# Altium project BreadBoard_project.PrjPcb (part 2 of 2)

## Sheet tmc4671_Output_Feedback.SchDoc: Output & Feedback
size A4 portrait; DocumentNumber: 3; SheetNumber: 6; SheetTotal: 6
Used 2 times, as channels U_tmc4671_eval/U_tmc4671_Output_Feedback, U_tmc4671_eval/U_tmc4671_Output_Feedback. Parts and nets are listed once, with the designators drawn on the sheet.
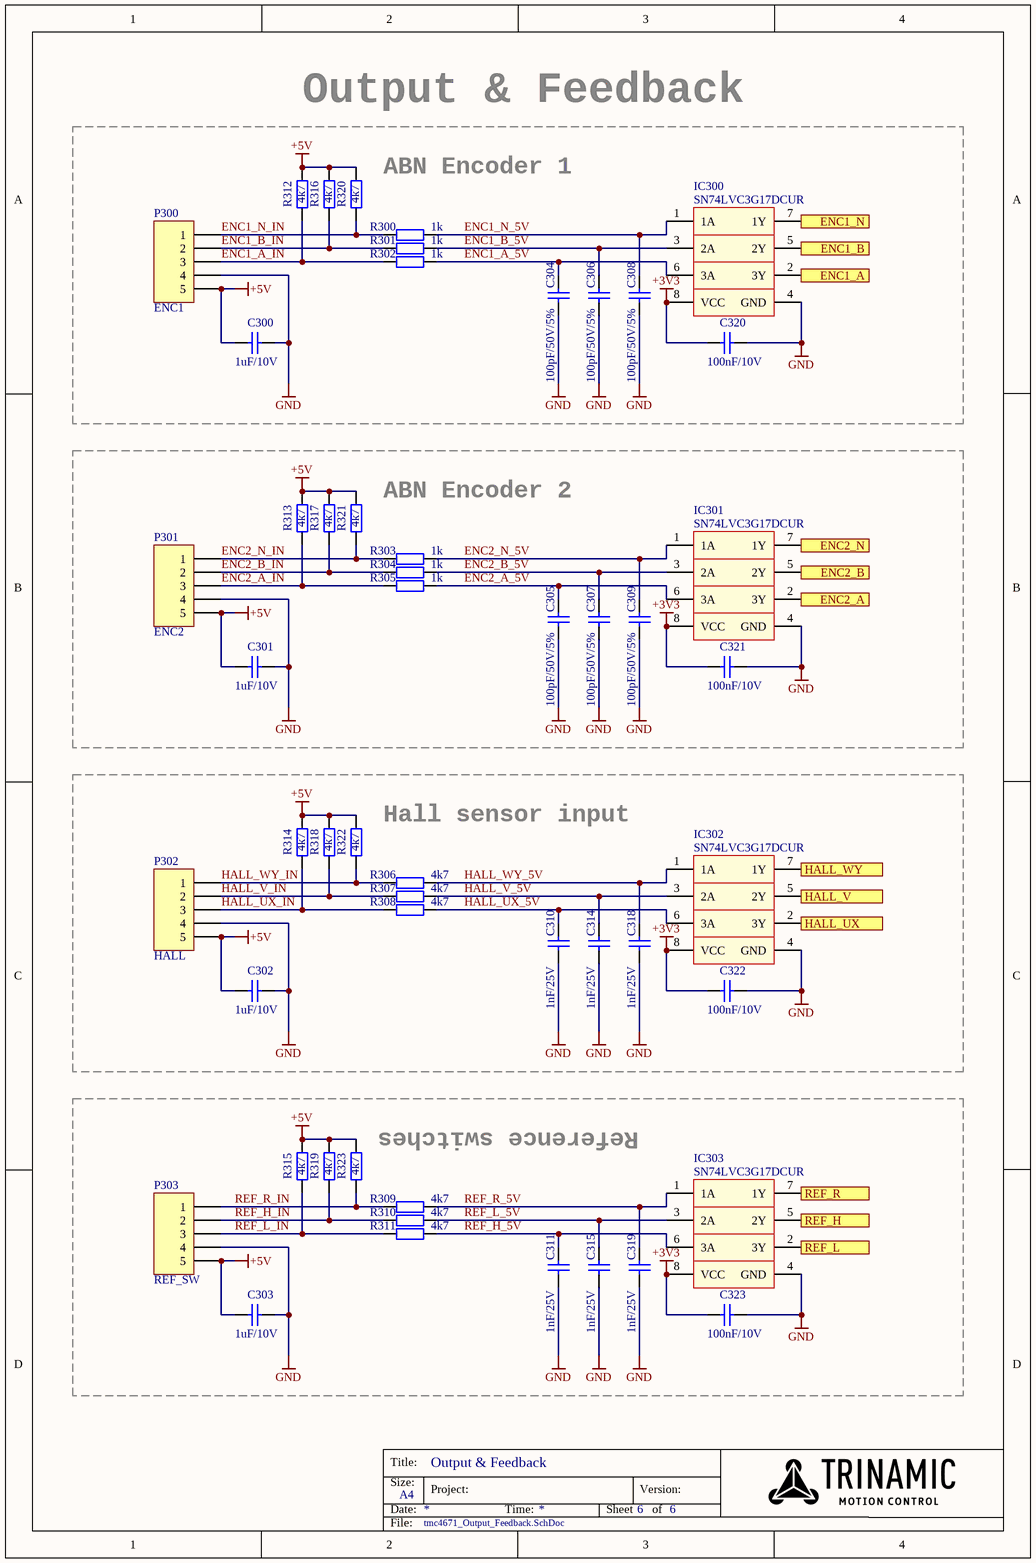
[diagram p5: tmc4671_Output_Feedback.SchDoc]

### Parts
C300  1uF/10V  [C0603]
C301  1uF/10V  [C0603]
C302  1uF/10V  [C0603]
C303  1uF/10V  [C0603]
C304  100pF/50V/5%  [C0603]
C305  100pF/50V/5%  [C0603]
C306  100pF/50V/5%  [C0603]
C307  100pF/50V/5%  [C0603]
C308  100pF/50V/5%  [C0603]
C309  100pF/50V/5%  [C0603]
C310  1nF/25V  [C0603]
C311  1nF/25V  [C0603]
C314  1nF/25V  [C0603]
C315  1nF/25V  [C0603]
C318  1nF/25V  [C0603]
C319  1nF/25V  [C0603]
C320  100nF/10V  [C0603]
C321  100nF/10V  [C0603]
C322  100nF/10V  [C0603]
C323  100nF/10V  [C0603]
IC300  SN74LVC3G17DCUR  [TSSOP50P310X90-8L]
IC301  SN74LVC3G17DCUR  [TSSOP50P310X90-8L]
IC302  SN74LVC3G17DCUR  [TSSOP50P310X90-8L]
IC303  SN74LVC3G17DCUR  [TSSOP50P310X90-8L]
P300  ENC1  [TH_HDR_1X5]
P301  ENC2  [TH_HDR_1X5]
P302  HALL  [TH_HDR_1X5]
P303  REF_SW  [TH_HDR_1X5]
R300  1k  [R0603]
R301  1k  [R0603]
R302  1k  [R0603]
R303  1k  [R0603]
R304  1k  [R0603]
R305  1k  [R0603]
R306  4k7  [R0603]
R307  4k7  [R0603]
R308  4k7  [R0603]
R309  4k7  [R0603]
R310  4k7  [R0603]
R311  4k7  [R0603]
R312  4k7  [R0603]
R313  4k7  [R0603]
R314  4k7  [R0603]
R315  4k7  [R0603]
R316  4k7  [R0603]
R317  4k7  [R0603]
R318  4k7  [R0603]
R319  4k7  [R0603]
R320  4k7  [R0603]
R321  4k7  [R0603]
R322  4k7  [R0603]
R323  4k7  [R0603]

### Blocks framed on the sheet
ABN Encoder 1: C300 C304 C306 C308 C320 IC300 P300 R300-R302 R312 R316 R320
ABN Encoder 2: C301 C305 C307 C309 C321 IC301 P301 R303-R305 R313 R317 R321
Hall sensor input: C302 C310 C314 C318 C322 IC302 P302 R306-R308 R314 R318 R322
Reference switches: C303 C311 C315 C319 C323 IC303 P303 R309-R311 R315 R319 R323

### Ports
ENC1_A, ENC1_B, ENC1_N, ENC2_A, ENC2_B, ENC2_N, HALL_UX, HALL_V, HALL_WY, REF_H, REF_L, REF_R

### Nets
+3V3: C320.2 C321.2 C322.2 C323.2 IC300.8(VCC) IC301.8(VCC) IC302.8(VCC) IC303.8(VCC)
+5V: C300.2 C301.2 C302.2 C303.2 P300.5 P301.5 P302.5 P303.5 R312.2 R313.2 R314.2 R315.2 R316.2 R317.2 R318.2 R319.2 R320.2 R321.2 R322.2 R323.2
GND: C300.1 C301.1 C302.1 C303.1 C304.1 C305.1 C306.1 C307.1 C308.1 C309.1 C310.1 C311.1 C314.1 C315.1 C318.1 C319.1 C320.1 C321.1 C322.1 C323.1 IC300.4(GND) IC301.4(GND) IC302.4(GND) IC303.4(GND) P300.4 P301.4 P302.4 P303.4
ENC1_A: IC300.2(3Y) ; port ENC1_A
ENC1_A_5V: C304.2 IC300.6(3A) R302.2
ENC1_A_IN: P300.3 R302.1 R312.1
ENC1_B: IC300.5(2Y) ; port ENC1_B
ENC1_B_5V: C306.2 IC300.3(2A) R301.2
ENC1_B_IN: P300.2 R301.1 R316.1
ENC1_N: IC300.7(1Y) ; port ENC1_N
ENC1_N_5V: C308.2 IC300.1(1A) R300.2
ENC1_N_IN: P300.1 R300.1 R320.1
ENC2_A: IC301.2(3Y) ; port ENC2_A
ENC2_A_5V: C305.2 IC301.6(3A) R305.2
ENC2_A_IN: P301.3 R305.1 R313.1
ENC2_B: IC301.5(2Y) ; port ENC2_B
ENC2_B_5V: C307.2 IC301.3(2A) R304.2
ENC2_B_IN: P301.2 R304.1 R317.1
ENC2_N: IC301.7(1Y) ; port ENC2_N
ENC2_N_5V: C309.2 IC301.1(1A) R303.2
ENC2_N_IN: P301.1 R303.1 R321.1
HALL_UX: IC302.2(3Y) ; port HALL_UX
HALL_UX_5V: C310.2 IC302.6(3A) R308.1
HALL_UX_IN: P302.3 R308.2 R314.1
HALL_V: IC302.5(2Y) ; port HALL_V
HALL_V_5V: C314.2 IC302.3(2A) R307.1
HALL_V_IN: P302.2 R307.2 R318.1
HALL_WY: IC302.7(1Y) ; port HALL_WY
HALL_WY_5V: C318.2 IC302.1(1A) R306.1
HALL_WY_IN: P302.1 R306.2 R322.1
REF_H: IC303.5(2Y) ; port REF_H
REF_H_5V: C311.2 IC303.6(3A) R311.1
REF_H_IN: P303.2 R310.2 R319.1
REF_L: IC303.2(3Y) ; port REF_L
REF_L_5V: C315.2 IC303.3(2A) R310.1
REF_L_IN: P303.3 R311.2 R315.1
REF_R: IC303.7(1Y) ; port REF_R
REF_R_5V: C319.2 IC303.1(1A) R309.1
REF_R_IN: P303.1 R309.2 R323.1

### Channels
U_tmc4671_eval/U_tmc4671_Output_Feedback: designators end in _U_tmc4671_eval_U_tmc4671_Output_Feedback#1; ports ENC1_A=inc_enc_a ENC1_B=inc_enc_b ENC1_N=NetIC300_U_tmc4671_eval_U_tmc4671_Output_Feedback#1_7 ENC2_A=NetIC301_U_tmc4671_eval_U_tmc4671_Output_Feedback#1_2 ENC2_B=NetIC301_U_tmc4671_eval_U_tmc4671_Output_Feedback#1_5 ENC2_N=NetIC301_U_tmc4671_eval_U_tmc4671_Output_Feedback#1_7 HALL_UX=NetIC302_U_tmc4671_eval_U_tmc4671_Output_Feedback#1_2 HALL_V=NetIC302_U_tmc4671_eval_U_tmc4671_Output_Feedback#1_5 HALL_WY=NetIC302_U_tmc4671_eval_U_tmc4671_Output_Feedback#1_7 REF_H=NetIC303_U_tmc4671_eval_U_tmc4671_Output_Feedback#1_5 REF_L=NetIC303_U_tmc4671_eval_U_tmc4671_Output_Feedback#1_2 REF_R=NetIC303_U_tmc4671_eval_U_tmc4671_Output_Feedback#1_7
U_tmc4671_eval/U_tmc4671_Output_Feedback: designators end in _U_tmc4671_eval_U_tmc4671_Output_Feedback#2; ports ENC1_A=inc_enc_a ENC1_B=inc_enc_b ENC1_N=NetIC300_U_tmc4671_eval_U_tmc4671_Output_Feedback#2_7 ENC2_A=NetIC301_U_tmc4671_eval_U_tmc4671_Output_Feedback#2_2 ENC2_B=NetIC301_U_tmc4671_eval_U_tmc4671_Output_Feedback#2_5 ENC2_N=NetIC301_U_tmc4671_eval_U_tmc4671_Output_Feedback#2_7 HALL_UX=NetIC302_U_tmc4671_eval_U_tmc4671_Output_Feedback#2_2 HALL_V=NetIC302_U_tmc4671_eval_U_tmc4671_Output_Feedback#2_5 HALL_WY=NetIC302_U_tmc4671_eval_U_tmc4671_Output_Feedback#2_7 REF_H=NetIC303_U_tmc4671_eval_U_tmc4671_Output_Feedback#2_5 REF_L=NetIC303_U_tmc4671_eval_U_tmc4671_Output_Feedback#2_2 REF_R=NetIC303_U_tmc4671_eval_U_tmc4671_Output_Feedback#2_7

### Notes on the sheet
- Title:
- Size:
- Date:
- A4
- Project:
- Time:
- Sheet
- Version:
- of
- File:

### Library data of the parts
C300-C303 = C, 1 µF, 10 V, ± 10%, X5R, MC Series, 0603 [1608 Metric]: SMD Multilayer Ceramic Capacitor, 0603 [1608 Metric], 1 µF, 10 V, ± 10%, X5R, MC Series; MPN: MC0603X105K100CT; Type: MLCC; VoltageRating: 10V; MF: MULTICOMP; Capacitance: 1uF; Characteristic: X5R; Precision: 10%
C304-C309 = C, 100 pF, 50 V, ± 5%, C0G / NP0, MC Series, 0603 [1608 Metric]: SMD Multilayer Ceramic Capacitor, 0603 [1608 Metric], 100 pF, 50 V, ± 5%, C0G / NP0, MC Series; MPN: MC0603N101J500CT; Type: MLCC; VoltageRating: 50V; MF: MULTICOMP; Capacitance: 100pF; Characteristic: C0G / NP0; Precision: 5%
C310 C311 C314 C315 C318 C319 = C, 1nF, 25 V, ± 10%, X7R, MC Series, 0603 [1608 Metric]: SMD Multilayer Ceramic Capacitor, 0603 [1608 Metric], 1000 pF, 25 V, ± 10%, X7R, MC Series; MPN: MC0603B102K250CT; Type: MLCC; VoltageRating: 25V; MF: MULTICOMP; Capacitance: 1nF; Characteristic: X7R; Precision: 10%
C320-C323 = C, 0.1 µF, 10 V, ± 10%, X7R, 0603: SMD Multilayer Ceramic Capacitor, 0603 [1608 Metric], 0.1 µF, 10 V, ± 10%, X7R, MC Series; MPN: MC0603B104K100CT; Type: MLCC; VoltageRating: 10V; MF: Multicomp; Capacitance: 100nF; Characteristic: X7R; ComponentLinknURL: *; Precision: 10%
IC300-IC303 = SN74LVC3G17DCUR: Triple Schmitt-Trigger Buffer, 74LVC3G17, 1.65 V to 5.5 V, VSSOP-8; MF: TEXAS INSTRUMENTS; MPN: SN74LVC3G17DCUR
P300-P303 = Header 5: Header, 5-Pin
R300-R305 = R, 1 kohm, 50 V, 0603 [1608 Metric], 100mW, ± 1%, MCWR Series: SMD Chip Resistor, Thick Film, 1 kohm, 50 V, 0603 [1608 Metric], 100 mW, ± 1%, MCWR Series; MPN: MCWR06X1001FTL; VoltageRating: 50V; Temp coefficient: *ppm; PowerRating: 100mW; MF: MULTICOMP; Precision: 1%; Resistance: 1k
R306-R323 = R, 4.7 kohm, 75 V, 0603 [1608 Metric], 100 mW, ± 1%, WR06 Series: SMD Chip Resistor, 4.7 kohm, 75 V, 0603 [1608 Metric], 100 mW, ± 1%, WR06 Series; MPN: WR06X4701FTL; VoltageRating: 75V; Temp coefficient: *ppm; PowerRating: 100mW; MF: WALSIN; Precision: 1%; Resistance: 4k7

## Sheet PowerStage.SchDoc: {Наименование}
size 420 x 297 mm; DocumentNumber: НРДЦ.ХХХХХХ.ХХХ ХХ; SheetNumber: 7; SheetTotal: 7; PageSetup: Record=PageOptions|CenterHorizontal=False|CenterVertical=False|PrintScale=0.95|XCorrection=0.00|YCorrection=0.00|PrintKind=1|BorderSize=5000000|LeftOffset=0|BottomOffset=0|Orientation=1|PaperLength=1000|PaperWidth=1000|Scale=100|PaperSource=15|PrintQuality=600|MediaType=1|DitherType=10|PaperKind=A4|PrintScaleMode=1; Rule: PcbType=ProtelPcb
Used 2 times, as channels U_PowerStage, U_PowerStage. Parts and nets are listed once, with the designators drawn on the sheet.
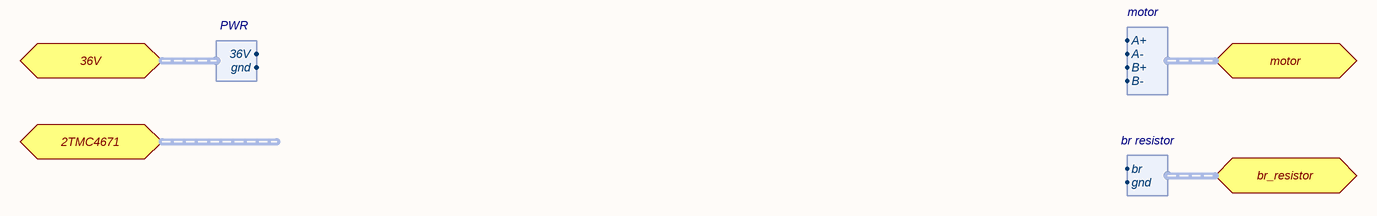
[diagram p6: PowerStage.SchDoc]

### Ports
2TMC4671 (bidir), 36V (bidir, harness PWR), br_resistor (bidir, harness br resistor), motor (bidir, harness motor)

### Harnesses
motor: A+, A-, B+, B-
br resistor: br, gnd
PWR: 36V, gnd

### Channels
U_PowerStage: no parts or ports
U_PowerStage: no parts or ports

### Notes on the sheet
- Подп. и дата
- Инв. № дубл.
- Взам. инв. №
- Инв. № подл.
- Лист
- Изм.
- № докум.
- Подп.
- Дата
- Копировал
- Формат А3

## Sheet differential.SchDoc: {Наименование}
size 420 x 297 mm; DocumentNumber: НРДЦ.ХХХХХХ.ХХХ ХХ; SheetNumber: 8; SheetTotal: 8; PageSetup: Record=PageOptions|CenterHorizontal=False|CenterVertical=False|PrintScale=0.95|XCorrection=0.00|YCorrection=0.00|PrintKind=1|BorderSize=5000000|LeftOffset=0|BottomOffset=0|Orientation=1|PaperLength=1000|PaperWidth=1000|Scale=100|PaperSource=15|PrintQuality=600|MediaType=1|DitherType=10|PaperKind=A4|PrintScaleMode=1; Rule: PcbType=ProtelPcb
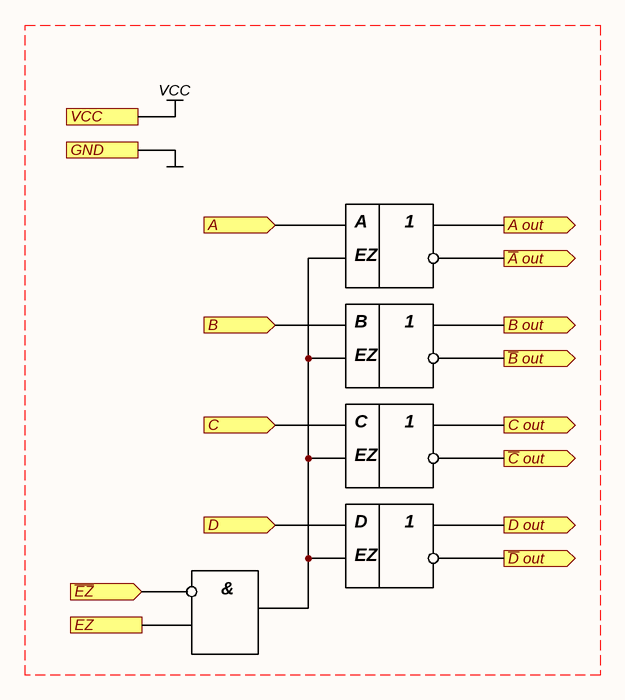
[diagram p7: differential.SchDoc]

### Ports
A (in), A out (out), B (in), B out (out), C (in), C out (out), D (in), D out (out), EZ, GND, VCC, ~{A} out (out), ~{B} out (out), ~{C} out (out), ~{D} out (out), ~{EZ} (in)

### Nets
ABS ENC AZ.gnd: port GND, port EZ

### Notes on the sheet
- A
- EZ
- 1
- B
- C
- D
- &
- Подп. и дата
- Инв. № дубл.
- Взам. инв. №
- Инв. № подл.
- Лист
- Изм.
- № докум.
- Подп.
- Дата
- Копировал
- Формат А3

## Nets that join several sheets
5V_EXT: Nucleo_H743ZI (CN?#3.6), U_tmc4671_eval/U_tmc4671_InterfaceConnectors (P1_U_tmc4671_eval_U_tmc4671_InterfaceConnectors#1.42 P2_U_tmc4671_eval_U_tmc4671_InterfaceConnectors#1.42 TP2_U_tmc4671_eval_U_tmc4671_InterfaceConnectors#1.1), U_tmc4671_eval/U_tmc4671_Output_Feedback (20 pins), U_tmc4671_eval/U_tmc4671_InterfaceConnectors (P1_U_tmc4671_eval_U_tmc4671_InterfaceConnectors#2.42 P2_U_tmc4671_eval_U_tmc4671_InterfaceConnectors#2.42 TP2_U_tmc4671_eval_U_tmc4671_InterfaceConnectors#2.1), U_tmc4671_eval/U_tmc4671_Output_Feedback (20 pins)
+3V3: U_tmc4671_eval/U_tmc4671_InterfaceConnectors (TP1_U_tmc4671_eval_U_tmc4671_InterfaceConnectors#1.1), U_tmc4671_eval/U_tmc4671_Output_Feedback (8 pins), U_tmc4671_eval/U_tmc4671_InterfaceConnectors (TP1_U_tmc4671_eval_U_tmc4671_InterfaceConnectors#2.1), U_tmc4671_eval/U_tmc4671_Output_Feedback (8 pins)
+5V_USB: U_tmc4671_eval/U_tmc4671_InterfaceConnectors (P1_U_tmc4671_eval_U_tmc4671_InterfaceConnectors#1.5 P2_U_tmc4671_eval_U_tmc4671_InterfaceConnectors#1.5), U_tmc4671_eval/U_tmc4671_InterfaceConnectors (P1_U_tmc4671_eval_U_tmc4671_InterfaceConnectors#2.5 P2_U_tmc4671_eval_U_tmc4671_InterfaceConnectors#2.5)
+VM: U_tmc4671_eval/U_tmc4671_InterfaceConnectors (P1_U_tmc4671_eval_U_tmc4671_InterfaceConnectors#1.1 P2_U_tmc4671_eval_U_tmc4671_InterfaceConnectors#1.1), U_tmc4671_eval/U_tmc4671_InterfaceConnectors (P1_U_tmc4671_eval_U_tmc4671_InterfaceConnectors#2.1 P2_U_tmc4671_eval_U_tmc4671_InterfaceConnectors#2.1)
ABS ENC AZ.gnd: Nucleo_H743ZI (30 pins), U_tmc4671_eval/U_tmc4671_InterfaceConnectors (17 pins), U_tmc4671_eval/U_tmc4671_Output_Feedback (28 pins), U_tmc4671_eval/U_tmc4671_InterfaceConnectors (17 pins), U_tmc4671_eval/U_tmc4671_Output_Feedback (28 pins)
inc_enc_a: U_tmc4671_eval/U_tmc4671_Output_Feedback (IC300_U_tmc4671_eval_U_tmc4671_Output_Feedback#1.2), U_tmc4671_eval/U_tmc4671_Output_Feedback (IC300_U_tmc4671_eval_U_tmc4671_Output_Feedback#2.2)
inc_enc_b: U_tmc4671_eval/U_tmc4671_Output_Feedback (IC300_U_tmc4671_eval_U_tmc4671_Output_Feedback#1.5), U_tmc4671_eval/U_tmc4671_Output_Feedback (IC300_U_tmc4671_eval_U_tmc4671_Output_Feedback#2.5)
spi tmc 2.cs: U_tmc4671_eval/U_tmc4671_InterfaceConnectors (P1_U_tmc4671_eval_U_tmc4671_InterfaceConnectors#1.30), U_tmc4671_eval/U_tmc4671_InterfaceConnectors (P1_U_tmc4671_eval_U_tmc4671_InterfaceConnectors#2.30)
spi tmc 2.en: U_tmc4671_eval/U_tmc4671_InterfaceConnectors (P1_U_tmc4671_eval_U_tmc4671_InterfaceConnectors#1.8), U_tmc4671_eval/U_tmc4671_InterfaceConnectors (P1_U_tmc4671_eval_U_tmc4671_InterfaceConnectors#2.8)
spi tmc 2.miso: U_tmc4671_eval/U_tmc4671_InterfaceConnectors (P1_U_tmc4671_eval_U_tmc4671_InterfaceConnectors#1.33), U_tmc4671_eval/U_tmc4671_InterfaceConnectors (P1_U_tmc4671_eval_U_tmc4671_InterfaceConnectors#2.33)
spi tmc 2.mosi: U_tmc4671_eval/U_tmc4671_InterfaceConnectors (P1_U_tmc4671_eval_U_tmc4671_InterfaceConnectors#1.32), U_tmc4671_eval/U_tmc4671_InterfaceConnectors (P1_U_tmc4671_eval_U_tmc4671_InterfaceConnectors#2.32)
spi tmc 2.sck: U_tmc4671_eval/U_tmc4671_InterfaceConnectors (P1_U_tmc4671_eval_U_tmc4671_InterfaceConnectors#1.31), U_tmc4671_eval/U_tmc4671_InterfaceConnectors (P1_U_tmc4671_eval_U_tmc4671_InterfaceConnectors#2.31)

## Assembly variants
Variant of BreadBoard_project: all parts fitted